# Altium schematic sheet [7]-H3_POWER.SchDoc
size A4
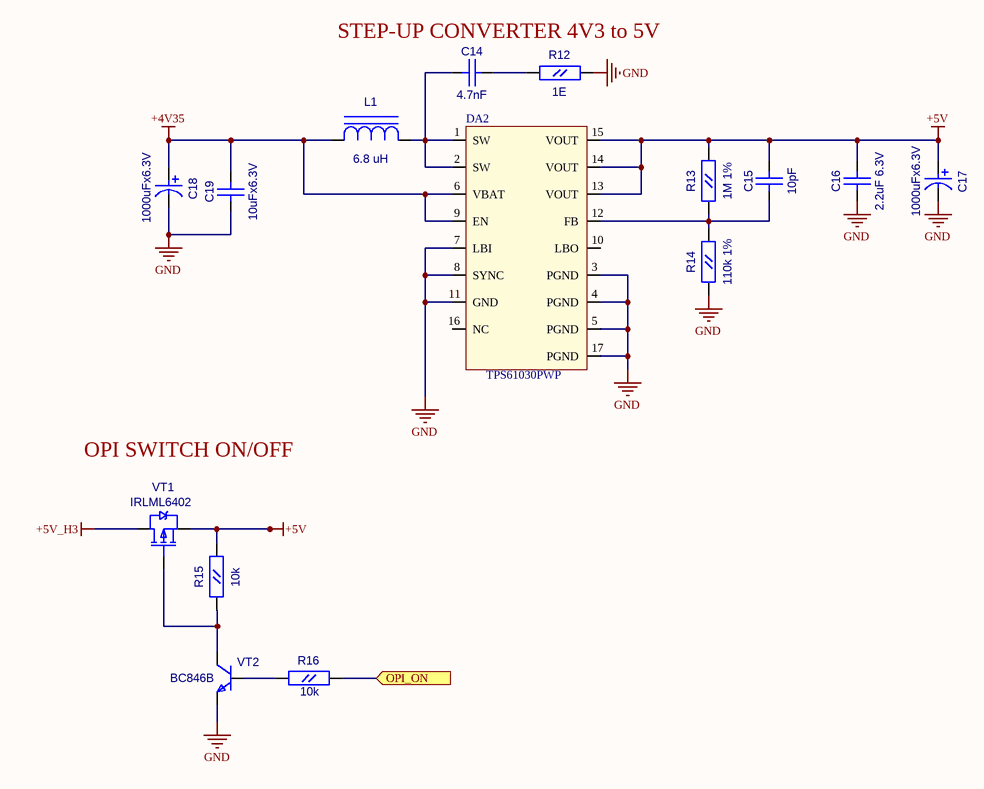
[diagram p0: [7]-H3_POWER.SchDoc]

## Parts
C14  4.7nF  [CC0603]
C15  10pF  [CC0603]
C16  2.2uF 6.3V  [CC0805]
C17  value 1000uFx6.3V  [CC8X3.5]  (hidden comment: CAP0.35)
C18  value 1000uFx6.3V  [CC8X3.5]  (hidden comment: CAP0.35)
C19  10uFx6.3V  [CC0805]
DA2  TPS61030PWP  [R-PDSO-G16]
L1  6.8 uH  [SDR0805]
R12  1E  [RC0603]
R13  1M 1%  [RC0603]
R14  110k 1%  [RC0603]
R15  10k  [RC0603]
R16  10k  [RC0603]
VT1  IRLML6402  [SOT-23(123)]
VT2  BC846B  [SOT-23(123)]

## Ports
OPI_ON (in)

## Nets
+4V35: C18.1 C19.2(B) DA2.6(VBAT) DA2.9(EN) L1.1(C)
+5V: C15.2(B) C16.2(B) C17.1 DA2.13(VOUT) DA2.14(VOUT) DA2.15(VOUT) R13.2(B) R15.2(B) VT1.2(S)
+5V_H3: VT1.3(D)
GND: C16.1(A) C17.2 C18.2 C19.1(A) DA2.3(PGND) DA2.4(PGND) DA2.5(PGND) DA2.7(LBI) DA2.8(SYNC) DA2.11(GND) DA2.17(PGND) R12.2(B) R14.1(A) VT2.2(E)
OPI_ON: R16.2(B) ; port OPI_ON
NetC14_1: C14.1(A) DA2.1(SW) DA2.2(SW) L1.2(A)
NetC14_2: C14.2(B) R12.1(A)
NetC15_1: C15.1(A) DA2.12(FB) R13.1(A) R14.2(B)
NetR15_1: R15.1(A) VT1.1(G) VT2.3(C)
NetR16_1: R16.1(A) VT2.1(B)

Not connected (* = marked no-connect by the designer): DA2 10(LBO) 16(NC)

## Notes on the sheet
- STEP-UP CONVERTER 4V3 to 5V
- OPI SWITCH ON/OFF

## Library data of the parts
C14 C15 = CC0603
  C14: Value: 4.7nF
  C15: Value: 10pF
C16 C19 = CC0805
  C16: Value: 2.2uF 6.3V
  C19: Value: 10uFx6.3V
DA2 = TPS61030PWP: Boost converter
L1 = SDR0805: Value: 6.8 uH
R12-R16 = RC0603
  R12: Value: 1E
  R13: Value: 1M 1%
  R14: Value: 110k 1%
  R15 R16: Value: 10k
VT1 = IRLML6402: HEXFET Power MOSFET; OriginalName: IRLML5103; ComponentField7: Published 8-Jun-2000; Value: IRLML6402
VT2 = BC846BLT1: ComponentField7: Published 29-Sep-2000; OriginalName: BC846BLT1; Value: BC846B